# Altium schematic sheet 03 POWER.SchDoc: POWER
size 420 x 297 mm; SheetNumber: 3; SheetTotal: 10
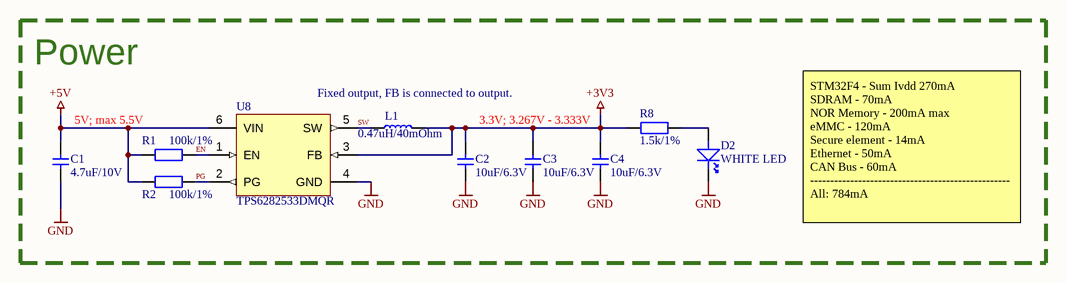
[diagram p0: 03 POWER.SchDoc]

## Parts
C1  4.7uF/10V  [CAPC1608X10M-0603]
C2  10uF/6.3V  [CAPC1005X06M-0402]
C3  10uF/6.3V  [CAPC1005X06M-0402]
C4  10uF/6.3V  [CAPC1005X06M-0402]
D2  WHITE LED  [LED-0402]
L1  0.47uH/40mOhm  [INDC200x160-2016]
R1  100k/1%  [RESC1005X04M-0402]
R2  100k/1%  [RESC1005X04M-0402]
R8  1.5k/1%  [RESC1005X04M-0402]
U8  TPS6282533DMQR  [VSON-HR (DMQ)]

## Nets
+3V3: C2.2 C3.2 C4.2 L1.2 R8.1 U8.3(FB)
+5V: C1.2 R1.2 R2.2 U8.6(VIN)
GND: C1.1 C2.1 C3.1 C4.1 D2.1 U8.4(GND)
EN: R1.1 U8.1(EN)
PG: R2.1 U8.2(PG)
SW: L1.1 U8.5(SW)
NetD2_2: D2.2 R8.2

## Notes on the sheet
- Power
- 5V; max 5.5V
- Fixed output, FB is connected to output.
- 3.3V; 3.267V - 3.333V
- STM32F4 - Sum Ivdd 270mA
  SDRAM - 70mA
  NOR Memory - 200mA max
  eMMC - 120mA
  Secure element - 14mA
  Ethernet - 50mA
  CAN Bus - 60mA
  --------------------------------------------------
  All: 784mA
- Title
- Project
- Size
- Date
- Revision
- A3
- Designed By

## Library data of the parts
C1 = GRM188C71A475KE11D: 4.7 µF ±10% 10V Ceramic Capacitor X7S 0603 (1608 Metric); ComponentLink1Description: Datasheet; ComponentLink1URL: https://search.murata.co.jp/Ceramy/image/img/A01X/G101/ENG/GRM188R60J476ME15-01.pdf; MPN: GRM188C71A475KE11D
C2-C4 = GRM155R60J106ME05J: 10 µF ±20% 6.3V Ceramic Capacitor X5R 0402 (1005 Metric); ComponentLink1Description: Datasheet; ComponentLink1URL: https://search.murata.co.jp/Ceramy/image/img/A01X/G101/ENG/GRM155R60J106ME05-01A.pdf; MPN: GRM155R60J106ME05J
D2 = QBLP595-IW-2897: White LED Indication - Discrete 3.1V 0402 (1005 Metric); ComponentLink1Description: Datasheet; ComponentLink1URL: https://www.qt-brightek.com/datasheet/QBLP595-IW-2897.pdf; MPN: QBLP595-IW-2897
L1 = SRP2010DPA-R47M: 470 nH Shielded Inductor 3.6 A 40mOhm Max 0806 (2016 Metric); ComponentLink1Description: Datasheet; ComponentLink1URL: https://media.digikey.com/pdf/Data%20Sheets/Bourns%20PDFs/SRP2010DPA_Series_DS.pdf; MPN: SRP2010DPA-R47M
R1 R2 = RC0402FR-07100KL: 100 kOhms ±1% 0.063W, 1/16W Chip Resistor 0402 (1005 Metric) Moisture Resistant Thick Film; ComponentLink1Description: Datasheet; ComponentLink1URL: https://www.yageo.com/upload/media/product/productsearch/datasheet/rchip/PYu-RC_Group_51_RoHS_L_12.pdf; MPN: RC0402FR-07100KL
R8 = RC0402FR-071K5L: 1.5 kOhms ±1% 0.063W, 1/16W Chip Resistor 0402 (1005 Metric) Moisture Resistant Thick Film; ComponentLink1Description: Datasheet; ComponentLink1URL: https://www.yageo.com/upload/media/product/productsearch/datasheet/rchip/PYu-RC_Group_51_RoHS_L_12.pdf; MPN: RC0402FR-071K5L
U8 = TPS6282533DMQR: Buck Switching Regulator IC Positive Fixed 3.3V 1 Output 2A 6-VFDFN; ComponentLink1Description: Datasheet; ComponentLink1URL: https://www.ti.com/lit/ds/symlink/tps62825.pdf; MPN: TPS6282533DMQR